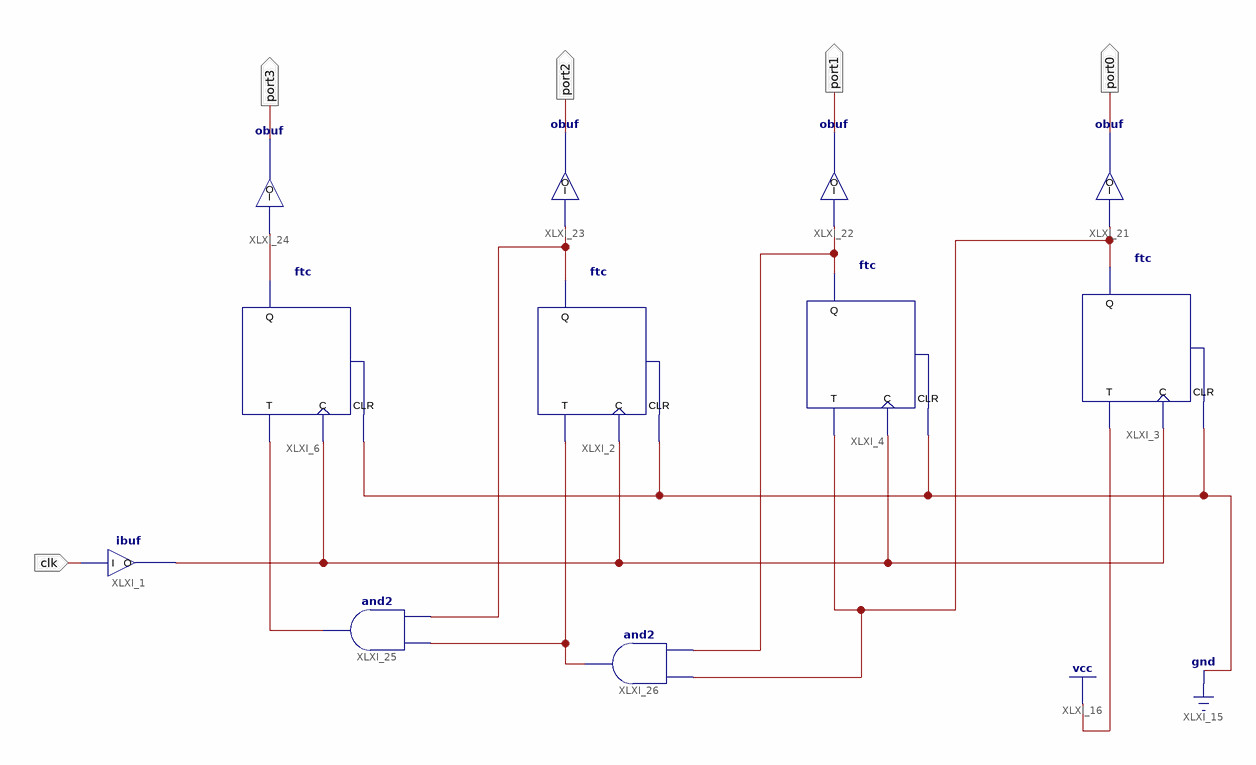
[diagram p0: schematic sheet 1]
// Xilinx ISE schematic T4.sch (spartan3) as structural Verilog: 11 symbols, 5 ports
module T4 (
  input  clk,
  output port0,
  output port1,
  output port2,
  output port3
);

  wire XLXN_1, XLXN_20, XLXN_21, XLXN_22, XLXN_33, XLXN_36, XLXN_38;

  ibuf XLXI_1 (.I(clk), .O(XLXN_1));
  ftc XLXI_3 (.C(XLXN_1), .CLR(1'b0), .T(1'b1), .Q(XLXN_33));
  ftc XLXI_4 (.C(XLXN_1), .CLR(1'b0), .T(XLXN_33), .Q(XLXN_20));
  ftc XLXI_2 (.C(XLXN_1), .CLR(1'b0), .T(XLXN_36), .Q(XLXN_21));
  ftc XLXI_6 (.C(XLXN_1), .CLR(1'b0), .T(XLXN_38), .Q(XLXN_22));
  and XLXI_26 (XLXN_36, XLXN_20, XLXN_33);
  obuf XLXI_21 (.I(XLXN_33), .O(port0));
  obuf XLXI_22 (.I(XLXN_20), .O(port1));
  obuf XLXI_23 (.I(XLXN_21), .O(port2));
  obuf XLXI_24 (.I(XLXN_22), .O(port3));
  and XLXI_25 (XLXN_38, XLXN_21, XLXN_36);
endmodule
